# EAGLE design 0120-DACz4 (EAGLE 9.6.2)
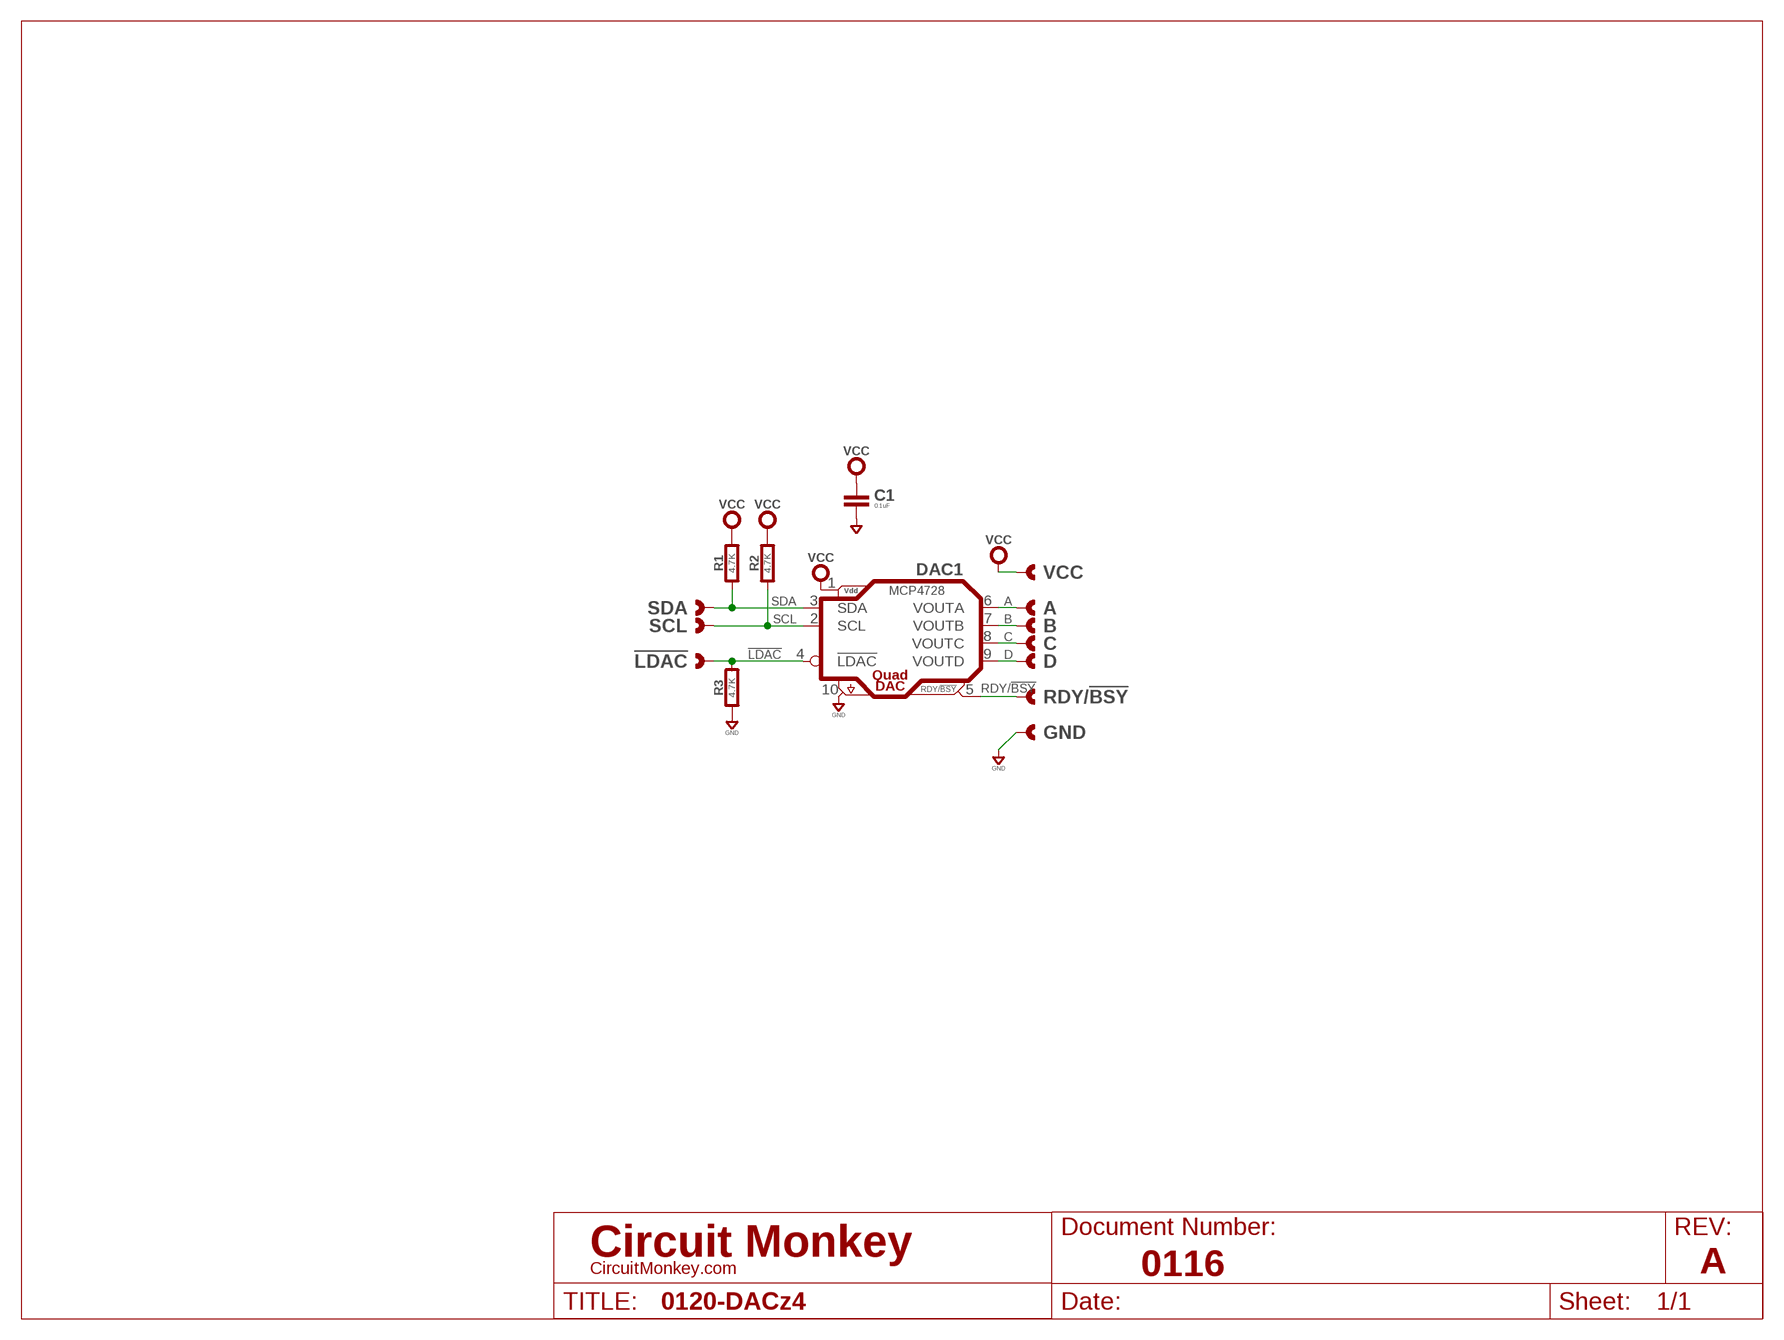
[diagram p0: schematic, sheet 1]
U$1 (LETTER_L-CIRCUITMONKEY): DOCUMENT_NUMBER: 0116; REV: A

## Parts
!LDAC  CAST-01X12.00MM  [CAST01-2.00MM]
A  CAST-01X12.00MM  [CAST01-2.00MM]
B  CAST-01X12.00MM  [CAST01-2.00MM]
C  CAST-01X12.00MM  [CAST01-2.00MM]
C1  0.1uF  CAPACITOR0603  [0603-CAP]
D  CAST-01X12.00MM  [CAST01-2.00MM]
DAC1  MCP4728  [MSOP10]
GND  CAST-01X12.00MM  [CAST01-2.00MM]
R1  4.7K  RESISTOR0603  [0603-RES]
R2  4.7K  RESISTOR0603  [0603-RES]
R3  4.7K  RESISTOR0603  [0603-RES]
RDY/!BSY  CAST-01X12.00MM  [CAST01-2.00MM]
SCL  CAST-01X12.00MM  [CAST01-2.00MM]
SDA  CAST-01X12.00MM  [CAST01-2.00MM]
VCC  CAST-01X12.00MM  [CAST01-2.00MM]

## Nets
!LDAC: !LDAC.1 !LDAC.P$1 !LDAC.P$2 DAC1.4(!LDAC) R3.2
A: A.1 A.P$1 A.P$2 DAC1.6(VOUTA)
B: B.1 B.P$1 B.P$2 DAC1.7(VOUTB)
C: C.1 C.P$1 C.P$2 DAC1.8(VOUTC)
D: D.1 D.P$1 D.P$2 DAC1.9(VOUTD)
GND: C1.2 DAC1.10(GND) GND.1 GND.P$1 GND.P$2 R3.1
RDY/!BSY: DAC1.5(RDY/!BSY) RDY/!BSY.1 RDY/!BSY.P$1 RDY/!BSY.P$2
SCL: DAC1.2(SCL) R2.1 SCL.1 SCL.P$1 SCL.P$2
SDA: DAC1.3(SDA) R1.1 SDA.1 SDA.P$1 SDA.P$2
VCC: C1.1 DAC1.1(VDD) R1.2 R2.2 VCC.1 VCC.P$1 VCC.P$2

## Library data of the parts
!LDAC A B C D GND RDY/!BSY SCL SDA VCC = con-headers:CAST-01X1: Castelated Edge Hole Pad
C1 = rlc:CAPACITOR: Capacitor; COST01: 0.12; COST10: 0.09; COST100: 0.05
DAC1 = co-microchip:MCP4728: Quad DAC with I2C; COST01: 2.55; COST10: 2.25; COST100: 1.95; MFR: Microchip; MPN: MCP4728
R1-R3 = rlc:RESISTOR: Resistor; COST01: 0.10; COST10: 0.05; COST100: 0.02

## Board
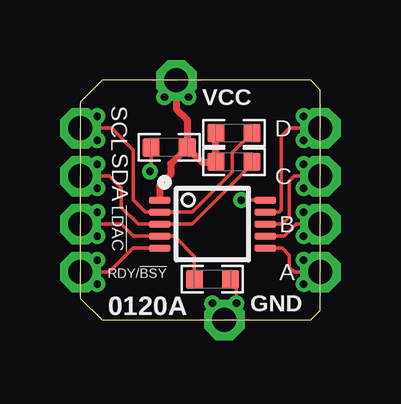
[diagram p1: board, top side]
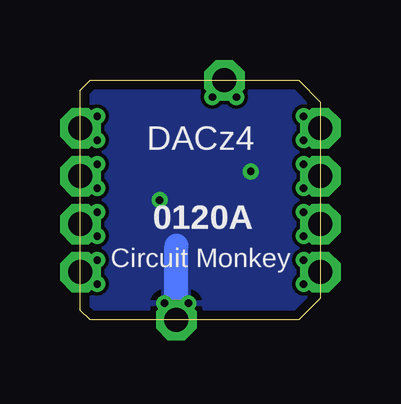
[diagram p2: board, bottom side, seen from below]

Size 10 x 10 mm. Coordinates in mm from the lower left corner, seen from the top.
Outline: 0.9,0 9.6,0 10,0.4 10,9.6 9.6,10 0.9,10 0,9.1 0,0.9 0.9,0
Copper layers (1*16): Top 0.0356mm / dielectric 0.7011mm / Bottom 0.0356mm
Design rules "OSH-CircuitMonkey *": minimum track width 6mil, minimum drill 12mil, track to track 6mil, track to pad 6mil, pad to pad 6mil, via to via 6mil, smd to smd 6mil, copper to edge 15mil, drill to drill 6mil, minimum pad ring 7mil, minimum via ring 7mil, stop-mask expansion 3mil, vias tented up to drill 13mil, thermal gap 10mil

### Footprints (pad centres in the part's own frame; a part is rotated, then mirrored left to right if it is on the bottom)
CAST01-2.00MM = drill 1 pad 1.7 octagon: 1 0,0 | drill 0.305: P$1 -0.7,0.5; P$2 -0.7,-0.5
0603-CAP = smd 0.711 x 0.762: 1 -0.752,0; 2 0.752,0
MSOP10 = smd 0.31 x 0.9: 1 -1,-2.2; 2 -0.5,-2.2; 3 0,-2.2; 4 0.5,-2.2; 5 1,-2.2; 6 1,2.2; 7 0.5,2.2; 8 0,2.2; 9 -0.5,2.2; 10 -1,2.2
0603-RES = smd 0.711 x 0.762: 1 -0.752,0; 2 0.752,0

### Placement (x,y rotation side)
!LDAC  0,4 180 top
A  10,2 0 top
B  10,4 0 top
C  10,6 0 top
C1  3.7,7.2 180 top
D  10,8 0 top
DAC1  5.5,4 270 top
GND  6,0 270 top
R1  6.4,6.6 180 top
R2  6.4,7.8 180 top
R3  5.5,1.7 180 top
RDY/!BSY  0,2 180 top
SCL  0,8 180 top
SDA  0,6 180 top
VCC  4,10 90 top

### Tracks (layer width: path | path; a pad name or v marks a point on that pad's centre or on a via)
!LDAC
  Top 0.152: 0.2,4 !LDAC.P$2 | 0.2,4 !LDAC.1 1.7,4 2.2,3.5 DAC1.4 3.9,3.5 4.75,2.65 R3.2 | 0.2,4 !LDAC.P$1
A
  Top 0.152: DAC1.6 8.4,3 8.7,2.7 8.7,2.2 8.9,2 A.1 9.8,2 | 9.8,2 A.P$1 | 9.8,2 A.P$2
B
  Top 0.152: DAC1.7 8.5,3.5 9,4 B.1 9.8,4 | 9.8,4 B.P$2 | 9.8,4 B.P$1
C
  Top 0.152: DAC1.8 8.4,4 8.7,4.3 8.7,5.8 8.9,6 C.1 9.8,6 | 9.8,6 C.P$2 | 9.8,6 C.P$1
D
  Top 0.152: DAC1.9 8.28,4.5 8.38,4.6 8.38,7.68 8.7,8 D.1 9.8,8 | 9.8,8 D.P$2 | 9.8,8 D.P$1
GND  (via drill 0.3)
  Top 0.152: C1.2 2.94,6.24 v2.9,6.2 | DAC1.10 v6.7,5 | GND.P$2 5.5,0.5 GND.1 6,0.2 GND.P$1 6.5,1.45 R3.1
  Bottom 1: GND.1 6,3.1
  pour Bottom: 0,0 0,10 10,10 10,0
RDY/!BSY
  Top 0.152: DAC1.5 2.2,3 1.2,2 RDY/!BSY.1 0.2,2 | 0.2,2 RDY/!BSY.P$2 | 0.2,2 RDY/!BSY.P$1
SCL
  Top 0.152: R2.1 6.33,6.98 6.33,6.17 4.67,4.5 DAC1.2 2.7,4.5 2.2,5 2.2,7.1 1.3,8 SCL.1 0.2,8 | SCL.P$2 0.2,8 | 0.2,8 SCL.P$1
SDA
  Top 0.152: R1.1 7.15,6.5 4.65,4 DAC1.3 2.4,4 1.7,4.7 1.7,5.5 1.2,6 SDA.1 0.2,6 | 0.2,6 SDA.P$2 | 0.2,6 SDA.P$1
VCC
  Top 0.152: VCC.P$2 4,9.8 | VCC.1 4,9.8 | 4,9.8 VCC.P$1
  Top 0.3: C1.1 3.76,6.51 3.76,6.07 3.3,5.61 DAC1.1 | R2.2 R1.2 5.05,6.6 C1.1 | C1.1 4.45,8.35 4,8.8 VCC.1

### Text on the board
tPlace: 0120A
bPlace: DACz4 | 0120A | Circuit Monkey